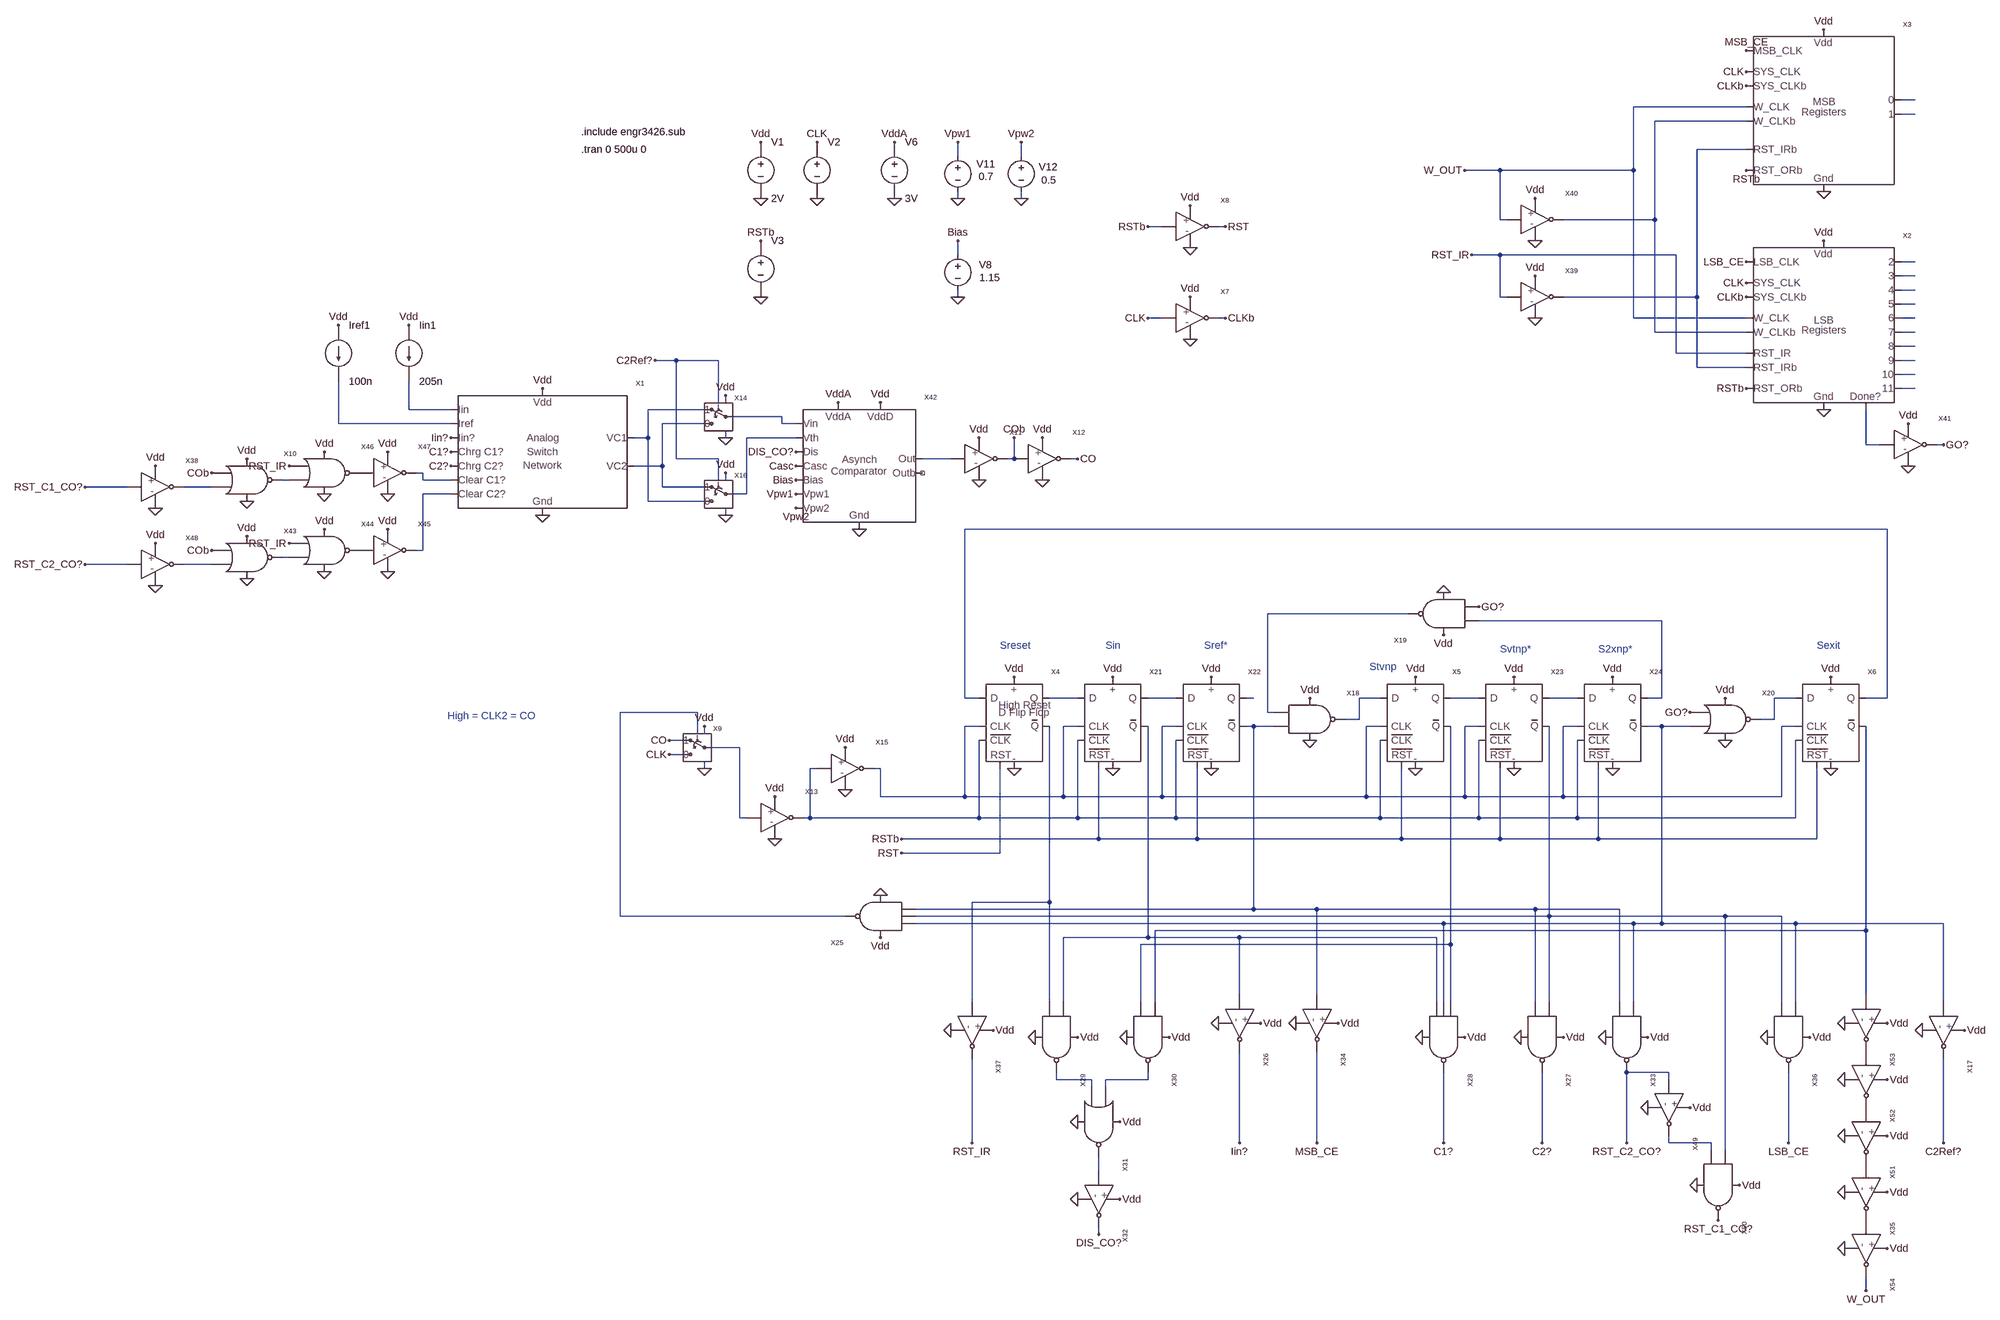
[diagram p0: schematic adc_test.asc]
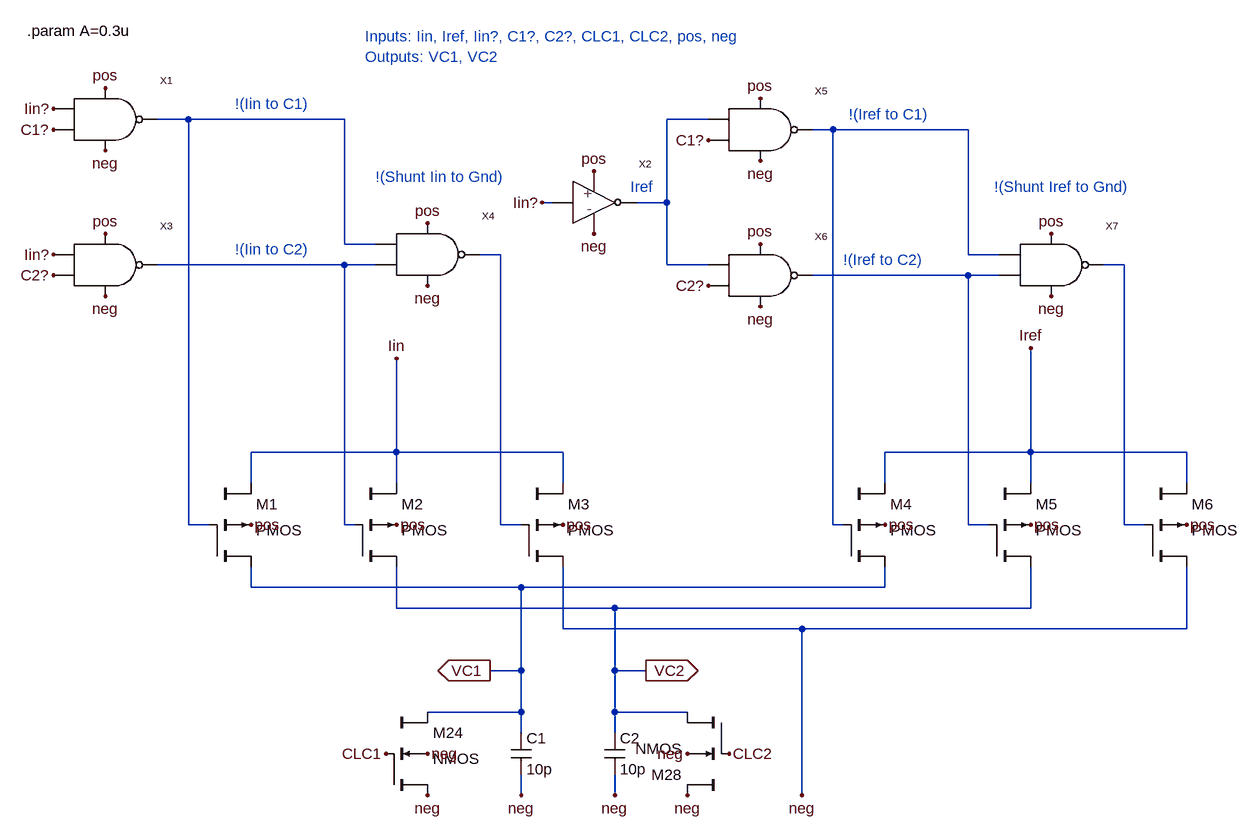
[diagram p1: sub-circuit analog_switch_current_steer.asc]
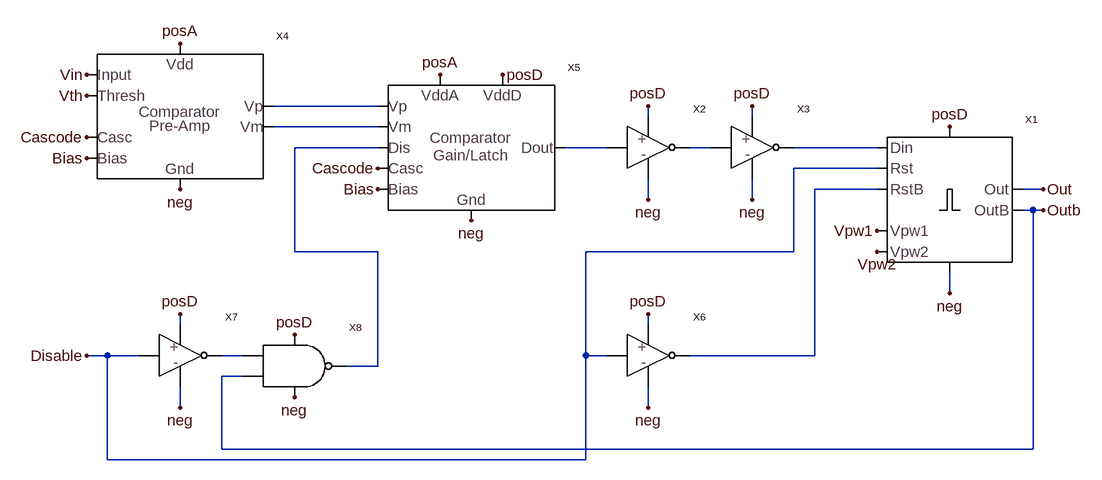
[diagram p2: sub-circuit comparator.asc]
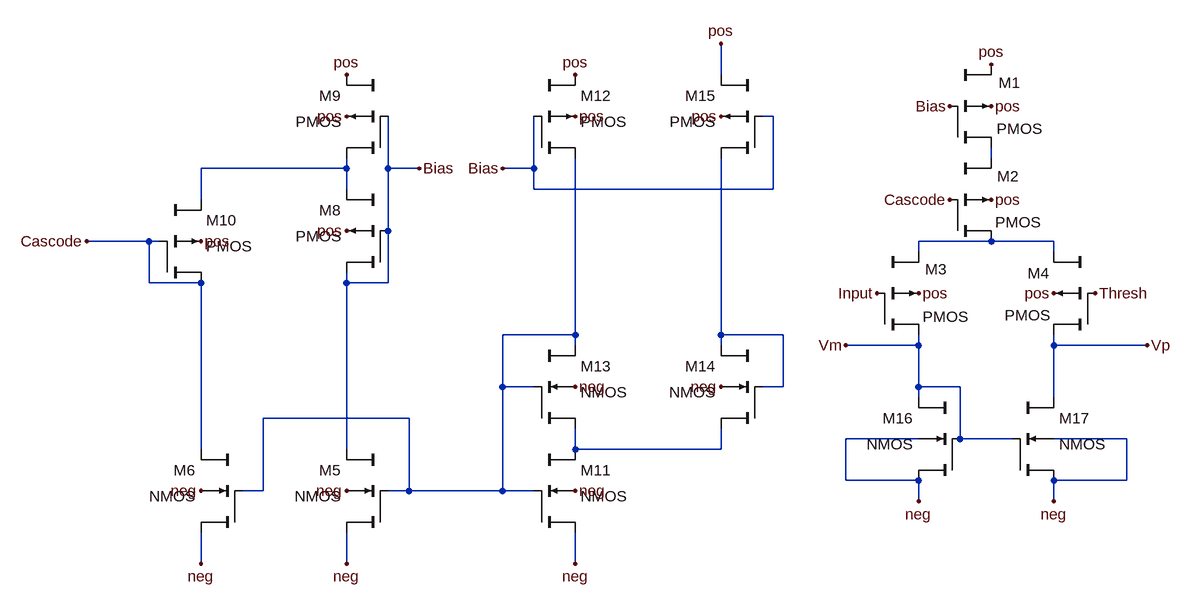
[diagram p3: sub-circuit comparator_preamp.asc]
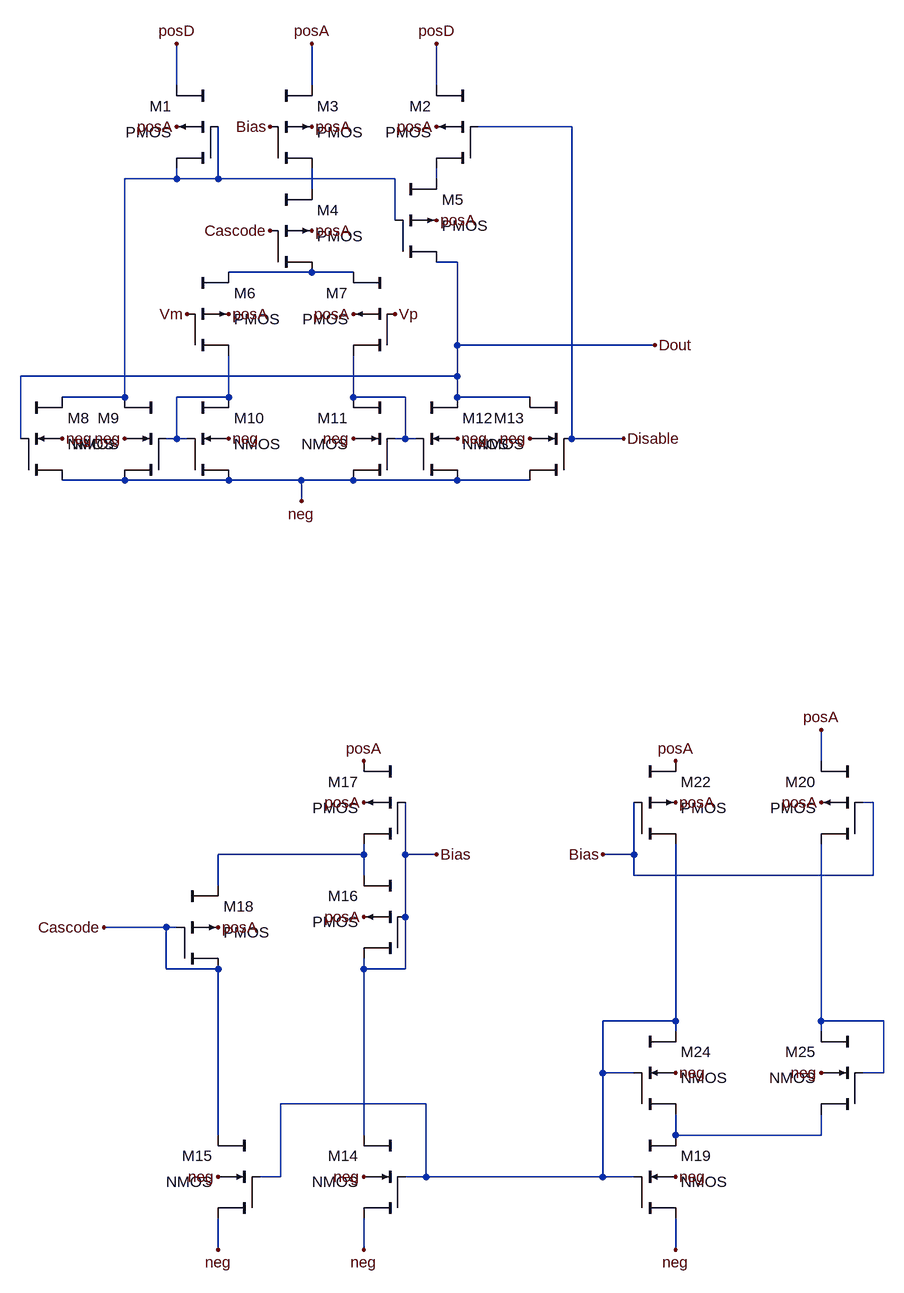
[diagram p4: sub-circuit comparator_gainlatch.asc]
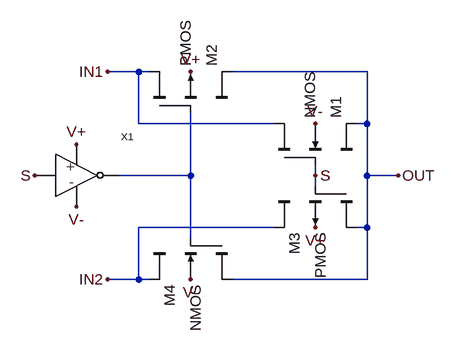
[diagram p5: sub-circuit spdt_1.asc]
adc_test.asc, the LTspice schematic file:
Version 4
SHEET 1 1476 2640
WIRE 1136 -288 1104 -288
WIRE 752 -272 496 -272
WIRE 1136 -256 1104 -256
WIRE 752 -240 544 -240
WIRE 752 -176 640 -176
WIRE -1040 -160 -1040 -192
WIRE -896 -160 -896 -192
WIRE 192 -128 112 -128
WIRE 496 -128 496 -272
WIRE 496 -128 192 -128
WIRE -1040 -64 -1040 -80
WIRE -896 -64 -896 -80
WIRE 192 -16 192 -128
WIRE 208 -16 192 -16
WIRE 544 -16 544 -240
WIRE 544 -16 336 -16
WIRE -576 0 -608 0
WIRE -432 0 -448 0
WIRE -1040 64 -1040 32
WIRE 192 64 128 64
WIRE 592 64 192 64
WIRE 1136 80 1104 80
WIRE 1136 112 1104 112
WIRE 1136 144 1104 144
WIRE -1040 160 -1040 144
WIRE 192 160 192 64
WIRE 208 160 192 160
WIRE 640 160 640 -176
WIRE 640 160 336 160
WIRE 1136 176 1104 176
WIRE -576 208 -608 208
WIRE -432 208 -448 208
WIRE 496 208 496 -128
WIRE 752 208 496 208
WIRE 1136 208 1104 208
WIRE 544 240 544 -16
WIRE 752 240 544 240
WIRE 1136 240 1104 240
WIRE 1136 272 1104 272
WIRE 592 288 592 64
WIRE 752 288 592 288
WIRE -1680 304 -1728 304
WIRE -1584 304 -1680 304
WIRE 1136 304 1104 304
WIRE 640 320 640 160
WIRE 752 320 640 320
WIRE 1136 336 1104 336
WIRE 1136 368 1104 368
WIRE -1584 400 -1584 304
WIRE -1568 400 -1568 384
WIRE -2288 416 -2288 352
WIRE -2192 416 -2288 416
WIRE -1616 416 -1744 416
WIRE -1440 432 -1552 432
WIRE -2448 448 -2448 352
WIRE -2192 448 -2448 448
WIRE -1616 448 -1712 448
WIRE -1440 448 -1440 432
WIRE -1408 448 -1440 448
WIRE -1744 480 -1744 416
WIRE -1744 480 -1776 480
WIRE -1568 480 -1568 464
WIRE -1408 480 -1520 480
WIRE 1024 496 1024 416
WIRE 1056 496 1024 496
WIRE 1200 496 1184 496
WIRE -1680 528 -1680 304
WIRE -1584 528 -1680 528
WIRE -1056 528 -1120 528
WIRE -912 528 -912 480
WIRE -912 528 -928 528
WIRE -768 528 -784 528
WIRE -1712 544 -1712 448
WIRE -1712 544 -1776 544
WIRE -2256 560 -2272 560
WIRE -2560 576 -2576 576
WIRE -2256 576 -2256 560
WIRE -2192 576 -2256 576
WIRE -1584 576 -1584 528
WIRE -1568 576 -1568 560
WIRE -2928 592 -3024 592
WIRE -2736 592 -2800 592
WIRE -1712 592 -1712 544
WIRE -1616 592 -1712 592
WIRE -2192 608 -2256 608
WIRE -1520 608 -1520 480
WIRE -1520 608 -1552 608
WIRE -1744 624 -1744 480
WIRE -1616 624 -1744 624
WIRE -1568 656 -1568 640
WIRE 1072 688 -1024 688
WIRE -2256 736 -2256 608
WIRE -2256 736 -2272 736
WIRE -2560 752 -2576 752
WIRE -2928 768 -3024 768
WIRE -2736 768 -2800 768
WIRE -16 880 -336 880
WIRE 560 896 144 896
WIRE -1024 1072 -1024 688
WIRE -992 1072 -1024 1072
WIRE -768 1072 -832 1072
WIRE -544 1072 -608 1072
WIRE -368 1072 -384 1072
WIRE -80 1072 -128 1072
WIRE 144 1072 80 1072
WIRE 368 1072 304 1072
WIRE 560 1072 560 896
WIRE 560 1072 528 1072
WIRE 864 1072 816 1072
WIRE 1072 1072 1072 688
WIRE 1072 1072 1024 1072
WIRE -1632 1104 -1808 1104
WIRE -336 1104 -336 880
WIRE -320 1104 -336 1104
WIRE -128 1120 -128 1072
WIRE -128 1120 -160 1120
WIRE 816 1120 816 1072
WIRE 816 1120 784 1120
WIRE -992 1136 -1024 1136
WIRE -768 1136 -800 1136
WIRE -544 1136 -576 1136
WIRE -368 1136 -384 1136
WIRE -320 1136 -368 1136
WIRE -80 1136 -112 1136
WIRE 144 1136 112 1136
WIRE 368 1136 336 1136
WIRE 560 1136 528 1136
WIRE 624 1136 560 1136
WIRE 864 1136 832 1136
WIRE -1632 1152 -1632 1104
WIRE -1616 1152 -1616 1136
WIRE -1664 1168 -1696 1168
WIRE -1536 1184 -1600 1184
WIRE -1664 1200 -1696 1200
WIRE -1616 1232 -1616 1216
WIRE -1360 1232 -1376 1232
WIRE -1216 1232 -1232 1232
WIRE -1216 1296 -1216 1232
WIRE -1024 1296 -1024 1136
WIRE -1024 1296 -1216 1296
WIRE -800 1296 -800 1136
WIRE -800 1296 -1024 1296
WIRE -576 1296 -576 1136
WIRE -576 1296 -800 1296
WIRE -112 1296 -112 1136
WIRE -112 1296 -576 1296
WIRE 112 1296 112 1136
WIRE 112 1296 -112 1296
WIRE 336 1296 336 1136
WIRE 336 1296 112 1296
WIRE 832 1296 832 1136
WIRE 832 1296 336 1296
WIRE -1536 1344 -1536 1184
WIRE -1520 1344 -1536 1344
WIRE -1376 1344 -1376 1232
WIRE -1376 1344 -1392 1344
WIRE -992 1344 -992 1168
WIRE -992 1344 -1376 1344
WIRE -768 1344 -768 1168
WIRE -768 1344 -992 1344
WIRE -544 1344 -544 1168
WIRE -544 1344 -768 1344
WIRE -80 1344 -80 1168
WIRE -80 1344 -544 1344
WIRE 144 1344 144 1168
WIRE 144 1344 -80 1344
WIRE 368 1344 368 1168
WIRE 368 1344 144 1344
WIRE 864 1344 864 1168
WIRE 864 1344 368 1344
WIRE -720 1392 -720 1232
WIRE -720 1392 -1168 1392
WIRE -496 1392 -496 1232
WIRE -496 1392 -720 1392
WIRE -32 1392 -32 1232
WIRE -32 1392 -496 1392
WIRE 192 1392 192 1232
WIRE 192 1392 -32 1392
WIRE 416 1392 416 1232
WIRE 416 1392 192 1392
WIRE 912 1392 912 1232
WIRE 912 1392 416 1392
WIRE -944 1424 -944 1232
WIRE -944 1424 -1168 1424
WIRE -832 1536 -832 1136
WIRE -832 1536 -1008 1536
WIRE -368 1552 -368 1136
WIRE -368 1552 -1136 1552
WIRE -224 1552 -368 1552
WIRE 272 1552 -224 1552
WIRE 464 1552 272 1552
WIRE -1808 1568 -1808 1104
WIRE -1296 1568 -1808 1568
WIRE 304 1568 304 1136
WIRE 304 1568 -1136 1568
WIRE 704 1568 304 1568
WIRE 832 1568 704 1568
WIRE 64 1584 -1136 1584
WIRE 496 1584 64 1584
WIRE 560 1584 560 1136
WIRE 560 1584 496 1584
WIRE 864 1584 560 1584
WIRE 1200 1584 864 1584
WIRE 1024 1600 1024 1136
WIRE 1024 1600 -592 1600
WIRE -608 1616 -608 1136
WIRE -608 1616 -800 1616
WIRE -400 1616 -608 1616
WIRE 48 1616 -400 1616
WIRE 80 1632 80 1136
WIRE 80 1632 -624 1632
WIRE -400 1792 -400 1616
WIRE -224 1792 -224 1552
WIRE 1024 1792 1024 1600
WIRE -1008 1808 -1008 1536
WIRE -832 1808 -832 1536
WIRE -800 1808 -800 1616
WIRE -624 1808 -624 1632
WIRE -592 1808 -592 1600
WIRE 48 1808 48 1616
WIRE 64 1808 64 1584
WIRE 80 1808 80 1632
WIRE 272 1808 272 1552
WIRE 304 1808 304 1568
WIRE 464 1808 464 1552
WIRE 496 1808 496 1584
WIRE 832 1808 832 1568
WIRE 864 1808 864 1584
WIRE 1200 1808 1200 1584
WIRE 576 1968 480 1968
WIRE -816 1984 -816 1968
WIRE -736 1984 -816 1984
WIRE -608 1984 -608 1968
WIRE -608 1984 -704 1984
WIRE 576 1984 576 1968
WIRE -736 2000 -736 1984
WIRE -704 2000 -704 1984
WIRE -1008 2128 -1008 1936
WIRE -400 2128 -400 1920
WIRE -224 2128 -224 1920
WIRE 64 2128 64 1968
WIRE 288 2128 288 1968
WIRE 480 2128 480 1968
WIRE 576 2128 576 2112
WIRE 672 2128 576 2128
WIRE 848 2128 848 1968
WIRE 1200 2128 1200 1936
WIRE 672 2144 672 2128
WIRE 704 2144 704 1568
WIRE -720 2192 -720 2160
WIRE -720 2336 -720 2320
WIRE 1024 2464 1024 2432
FLAG -1360 -192 CLK
FLAG -1360 -64 0
FLAG -1488 -64 0
FLAG -912 1232 0
FLAG 0 1232 0
FLAG 944 1232 0
FLAG -1488 -192 Vdd
FLAG -912 1024 Vdd
FLAG 0 1024 Vdd
FLAG 944 1024 Vdd
FLAG -1488 160 0
FLAG -1488 32 RSTb
FLAG -1168 1392 RSTb
FLAG -1696 1200 CLK
FLAG -1456 1392 0
FLAG -1456 1296 Vdd
FLAG -1696 1168 CO
FLAG 144 864 GO?
FLAG -240 1168 0
FLAG 64 832 0
FLAG -240 1072 Vdd
FLAG 64 928 Vdd
FLAG 624 1104 GO?
FLAG 704 1168 0
FLAG 704 1072 Vdd
FLAG -688 1232 0
FLAG -688 1024 Vdd
FLAG -464 1232 0
FLAG -464 1024 Vdd
FLAG 224 1232 0
FLAG 224 1024 Vdd
FLAG 448 1232 0
FLAG 448 1024 Vdd
FLAG -1216 1520 0
FLAG -1216 1616 Vdd
FLAG -352 1856 Vdd
FLAG -448 1856 0
FLAG -400 2128 Iin?
FLAG 112 1888 Vdd
FLAG 16 1888 0
FLAG 64 2128 C1?
FLAG 336 1888 Vdd
FLAG 240 1888 0
FLAG 288 2128 C2?
FLAG -864 1888 0
FLAG -656 1888 0
FLAG -768 1888 Vdd
FLAG -560 1888 Vdd
FLAG -720 2336 DIS_CO?
FLAG -768 2080 0
FLAG -768 2256 0
FLAG -672 2080 Vdd
FLAG -672 2256 Vdd
FLAG 528 1888 Vdd
FLAG 432 1888 0
FLAG 480 2128 RST_C2_CO?
FLAG -176 1856 Vdd
FLAG -272 1856 0
FLAG -224 2128 MSB_CE
FLAG 1024 2464 W_OUT
FLAG 896 1888 Vdd
FLAG 800 1888 0
FLAG 848 2128 LSB_CE
FLAG -960 1872 Vdd
FLAG -1056 1872 0
FLAG -1008 2128 RST_IR
FLAG -1984 368 Vdd
FLAG -1984 656 0
FLAG -2192 480 Iin?
FLAG -2288 224 Vdd
FLAG -2448 224 Vdd
FLAG -2192 512 C1?
FLAG -2192 544 C2?
FLAG -3024 592 RST_C1_CO?
FLAG -2864 640 0
FLAG -2864 544 Vdd
FLAG 752 -400 MSB_CE
FLAG 928 -448 Vdd
FLAG 928 32 Vdd
FLAG 928 -80 0
FLAG 928 416 0
FLAG 752 80 LSB_CE
FLAG 752 368 RSTb
FLAG 752 -128 RSTb
FLAG 128 64 RST_IR
FLAG 272 208 0
FLAG 272 112 Vdd
FLAG 112 -128 W_OUT
FLAG 272 32 0
FLAG 272 -64 Vdd
FLAG 1120 544 0
FLAG 1120 448 Vdd
FLAG 1200 496 GO?
FLAG -1264 688 0
FLAG -1408 512 DIS_CO?
FLAG -912 480 COb
FLAG -1216 400 Vdd
FLAG -1184 -64 0
FLAG -1184 -192 VddA
FLAG -1312 400 VddA
FLAG -1040 -64 0
FLAG -1040 -192 Vpw1
FLAG -896 -64 0
FLAG -896 -192 Vpw2
FLAG -1040 160 0
FLAG -1040 32 Bias
FLAG -1408 544 Casc
FLAG -1408 576 Bias
FLAG -1408 608 Vpw1
FLAG -1408 640 Vpw2
FLAG -512 256 0
FLAG -512 160 Vdd
FLAG -608 208 CLK
FLAG -432 208 CLKb
FLAG 752 -352 CLK
FLAG 752 -320 CLKb
FLAG 752 160 CLKb
FLAG 752 128 CLK
FLAG -768 528 CO
FLAG -2656 624 0
FLAG -2656 528 Vdd
FLAG -2736 560 COb
FLAG -2656 800 0
FLAG -2656 704 Vdd
FLAG -2736 736 COb
FLAG -2480 784 0
FLAG -2336 784 0
FLAG -2480 688 Vdd
FLAG -2336 688 Vdd
FLAG -2480 608 0
FLAG -2336 608 0
FLAG -2480 512 Vdd
FLAG -2336 512 Vdd
FLAG -2560 720 RST_IR
FLAG -2560 544 RST_IR
FLAG -2864 816 0
FLAG -2864 720 Vdd
FLAG -3024 768 RST_C2_CO?
FLAG 624 2048 Vdd
FLAG 528 2048 0
FLAG 736 2224 Vdd
FLAG 640 2224 0
FLAG 688 2304 RST_C1_CO?
FLAG -1168 1424 RST
FLAG -512 48 0
FLAG -512 -48 Vdd
FLAG -608 0 RSTb
FLAG -432 0 RST
FLAG -1616 1136 Vdd
FLAG -1616 1232 0
FLAG -992 576 0
FLAG -992 480 Vdd
FLAG -848 576 0
FLAG -848 480 Vdd
FLAG -1568 384 Vdd
FLAG -1568 480 0
FLAG -1296 1280 0
FLAG -1296 1184 Vdd
FLAG -1568 560 Vdd
FLAG -1568 656 0
FLAG 1248 1872 Vdd
FLAG 1152 1872 0
FLAG 1200 2128 C2Ref?
FLAG -1728 304 C2Ref?
FLAG 1072 2368 Vdd
FLAG 976 2368 0
FLAG 1072 2240 Vdd
FLAG 976 2240 0
FLAG 1072 2112 Vdd
FLAG 976 2112 0
FLAG 1072 1984 Vdd
FLAG 976 1984 0
FLAG 1072 1856 Vdd
FLAG 976 1856 0
SYMBOL analog_switch_current_steer -1984 512 R0
SYMATTR InstName X1
SYMBOL lsb_registers 928 224 R0
SYMATTR InstName X2
SYMBOL msb_registers 928 -272 R0
SYMATTR InstName X3
SYMBOL FlipFlop 0 1136 R0
SYMATTR InstName X5
SYMATTR SpiceLine nmosL=0.9u nmosW=3u pmosL=0.9u pmosW=6u
SYMBOL FlipFlop 944 1136 R0
SYMATTR InstName X6
SYMATTR SpiceLine nmosL=0.9u nmosW=3u pmosL=0.9u pmosW=6u
SYMBOL cktsym\\vsource -1488 -128 R0
WINDOW 123 0 0 Left 2
WINDOW 39 0 0 Left 2
SYMATTR Value 2V
SYMATTR InstName V1
SYMBOL cktsym\\vsource -1360 -128 R0
WINDOW 3 48 12 Invisible 2
WINDOW 123 0 0 Left 2
WINDOW 39 0 0 Left 2
SYMATTR Value PULSE(0 2 .2u 1n 1n 5u 10u 50)
SYMATTR InstName V2
SYMBOL cktsym\\vsource -1488 96 R0
WINDOW 3 48 16 Invisible 2
WINDOW 123 0 0 Left 2
WINDOW 39 0 0 Left 2
SYMATTR Value PWL(0 0 300n 0 325n 2 40u 2)
SYMATTR InstName V3
SYMBOL Inverter -1456 1344 R0
SYMATTR InstName X13
SYMATTR SpiceLine nmosL=0.9u nmosW=6u pmosL=0.9u pmosW=12u
SYMBOL NAND -240 1120 R0
SYMATTR InstName X18
SYMATTR SpiceLine nmosL=0.9u nmosW=3u pmosL=0.9u pmosW=6u
SYMBOL NAND 64 880 R180
SYMATTR InstName X19
SYMATTR SpiceLine nmosL=0.9u nmosW=3u pmosL=0.9u pmosW=6u
SYMBOL NOR 704 1120 R0
SYMATTR InstName X20
SYMATTR SpiceLine nmosL=0.9u nmosW=3u pmosL=0.9u pmosW=6u
SYMBOL FlipFlop -688 1136 R0
SYMATTR InstName X21
SYMATTR SpiceLine nmosL=0.9u nmosW=3u pmosL=0.9u pmosW=6u
SYMBOL FlipFlop -464 1136 R0
SYMATTR InstName X22
SYMATTR SpiceLine nmosL=0.9u nmosW=3u pmosL=0.9u pmosW=6u
SYMBOL FlipFlop 224 1136 R0
SYMATTR InstName X23
SYMATTR SpiceLine nmosL=0.9u nmosW=3u pmosL=0.9u pmosW=6u
SYMBOL FlipFlop 448 1136 R0
SYMATTR InstName X24
SYMATTR SpiceLine nmosL=0.9u nmosW=3u pmosL=0.9u pmosW=6u
SYMBOL NAND3 -1216 1568 R180
SYMATTR InstName X25
SYMATTR SpiceLine nmosL=0.9u nmosW=3u pmosL=0.9u pmosW=6u
SYMBOL Inverter -400 1856 R90
SYMATTR InstName X26
SYMATTR SpiceLine nmosL=0.9u nmosW=3u pmosL=0.9u pmosW=6u
SYMBOL NAND 288 1888 R90
SYMATTR InstName X27
SYMATTR SpiceLine nmosL=0.9u nmosW=3u pmosL=0.9u pmosW=6u
SYMBOL NAND3 64 1888 R90
SYMATTR InstName X28
SYMATTR SpiceLine nmosL=0.9u nmosW=3u pmosL=0.9u pmosW=6u
SYMBOL NAND -816 1888 R90
SYMATTR InstName X29
SYMATTR SpiceLine nmosL=0.9u nmosW=3u pmosL=0.9u pmosW=6u
SYMBOL NAND -608 1888 R90
SYMATTR InstName X30
SYMATTR SpiceLine nmosL=0.9u nmosW=3u pmosL=0.9u pmosW=6u
SYMBOL NOR -720 2080 R90
SYMATTR InstName X31
SYMATTR SpiceLine nmosL=0.9u nmosW=3u pmosL=0.9u pmosW=6u
SYMBOL Inverter -720 2256 R90
SYMATTR InstName X32
SYMATTR SpiceLine nmosL=0.9u nmosW=3u pmosL=0.9u pmosW=6u
SYMBOL Inverter -224 1856 R90
SYMATTR InstName X34
SYMATTR SpiceLine nmosL=0.9u nmosW=6u pmosL=0.9u pmosW=12u
SYMBOL NAND 848 1888 R90
SYMATTR InstName X36
SYMATTR SpiceLine nmosL=0.9u nmosW=9u pmosL=0.9u pmosW=18u
SYMBOL Inverter -1008 1872 R90
SYMATTR InstName X37
SYMATTR SpiceLine nmosL=0.9u nmosW=3u pmosL=0.9u pmosW=6u
SYMBOL cktsym\\isource -2288 288 R0
WINDOW 123 0 0 Left 2
WINDOW 39 0 0 Left 2
SYMATTR Value 205n
SYMATTR InstName Iin1
SYMBOL cktsym\\isource -2448 288 R0
WINDOW 123 0 0 Left 2
WINDOW 39 0 0 Left 2
SYMATTR Value 100n
SYMATTR InstName Iref1
SYMBOL Inverter -2864 592 R0
SYMATTR InstName X38
SYMATTR SpiceLine nmosL=0.9u nmosW=3u pmosL=0.9u pmosW=6u
SYMBOL Inverter 272 160 R0
SYMATTR InstName X39
SYMATTR SpiceLine nmosL=0.9u nmosW=9u pmosL=0.9u pmosW=18u
SYMBOL Inverter 272 -16 R0
SYMATTR InstName X40
SYMATTR SpiceLine nmosL=0.9u nmosW=9u pmosL=0.9u pmosW=18u
SYMBOL Inverter 1120 496 R0
SYMATTR InstName X41
SYMATTR SpiceLine nmosL=0.9u nmosW=3u pmosL=0.9u pmosW=6u
SYMBOL comparator -1264 544 R0
SYMATTR InstName X42
SYMBOL cktsym\\vsource -1184 -128 R0
WINDOW 123 0 0 Left 2
WINDOW 39 0 0 Left 2
SYMATTR Value 3V
SYMATTR InstName V6
SYMBOL voltage -1040 -176 R0
WINDOW 123 0 0 Left 2
WINDOW 39 0 0 Left 2
WINDOW 0 42 34 Left 2
WINDOW 3 47 62 Left 2
SYMATTR InstName V11
SYMATTR Value 0.7
SYMBOL voltage -896 -176 R0
WINDOW 123 0 0 Left 2
WINDOW 39 0 0 Left 2
WINDOW 0 40 40 Left 2
WINDOW 3 46 70 Left 2
SYMATTR InstName V12
SYMATTR Value 0.5
SYMBOL voltage -1040 48 R0
WINDOW 123 0 0 Left 2
WINDOW 39 0 0 Left 2
WINDOW 0 48 39 Left 2
WINDOW 3 49 68 Left 2
SYMATTR InstName V8
SYMATTR Value 1.15
SYMBOL Inverter -512 208 R0
SYMATTR InstName X7
SYMATTR SpiceLine nmosL=0.9u nmosW=9u pmosL=0.9u pmosW=18u
SYMBOL NOR -2656 576 R0
SYMATTR InstName X10
SYMATTR SpiceLine nmosL=0.9u nmosW=3u pmosL=0.9u pmosW=6u
SYMBOL NOR -2656 752 R0
SYMATTR InstName X43
SYMATTR SpiceLine nmosL=0.9u nmosW=3u pmosL=0.9u pmosW=6u
SYMBOL NOR -2480 736 R0
SYMATTR InstName X44
SYMATTR SpiceLine nmosL=0.9u nmosW=3u pmosL=0.9u pmosW=6u
SYMBOL Inverter -2336 736 R0
SYMATTR InstName X45
SYMATTR SpiceLine nmosL=0.9u nmosW=3u pmosL=0.9u pmosW=6u
SYMBOL NOR -2480 560 R0
SYMATTR InstName X46
SYMATTR SpiceLine nmosL=0.9u nmosW=3u pmosL=0.9u pmosW=6u
SYMBOL Inverter -2336 560 R0
SYMATTR InstName X47
SYMATTR SpiceLine nmosL=0.9u nmosW=3u pmosL=0.9u pmosW=6u
SYMBOL Inverter -2864 768 R0
SYMATTR InstName X48
SYMATTR SpiceLine nmosL=0.9u nmosW=3u pmosL=0.9u pmosW=6u
SYMBOL Inverter 576 2048 R90
SYMATTR InstName X49
SYMATTR SpiceLine nmosL=0.9u nmosW=3u pmosL=0.9u pmosW=6u
SYMBOL NAND 688 2224 R90
SYMATTR InstName X50
SYMATTR SpiceLine nmosL=0.9u nmosW=3u pmosL=0.9u pmosW=6u
SYMBOL NAND 480 1888 R90
SYMATTR InstName X33
SYMATTR SpiceLine nmosL=0.9u nmosW=3u pmosL=0.9u pmosW=6u
SYMBOL highResetFlipFlop -912 1136 R0
SYMATTR InstName X4
SYMATTR SpiceLine nmosL=0.9u nmosW=3u pmosL=0.9u pmosW=6u
SYMBOL Inverter -512 0 R0
SYMATTR InstName X8
SYMATTR SpiceLine nmosL=0.9u nmosW=9u pmosL=0.9u pmosW=18u
SYMBOL SPDT_1 -1616 1184 R0
SYMATTR InstName X9
SYMATTR SpiceLine nmosL=0.9u nmosW=3u pmosL=0.9u pmosW=6u
SYMBOL Inverter -992 528 R0
SYMATTR InstName X11
SYMATTR SpiceLine nmosL=0.9u nmosW=6u pmosL=0.9u pmosW=12u
SYMBOL Inverter -848 528 R0
SYMATTR InstName X12
SYMATTR SpiceLine nmosL=0.9u nmosW=6u pmosL=0.9u pmosW=12u
SYMBOL SPDT_1 -1568 432 R0
SYMATTR InstName X14
SYMATTR SpiceLine nmosL=0.9u nmosW=3u pmosL=0.9u pmosW=6u
SYMBOL Inverter -1296 1232 R0
SYMATTR InstName X15
SYMATTR SpiceLine nmosL=0.9u nmosW=6u pmosL=0.9u pmosW=12u
SYMBOL SPDT_1 -1568 608 R0
SYMATTR InstName X16
SYMATTR SpiceLine nmosL=0.9u nmosW=3u pmosL=0.9u pmosW=6u
SYMBOL Inverter 1200 1872 R90
SYMATTR InstName X17
SYMATTR SpiceLine nmosL=0.9u nmosW=3u pmosL=0.9u pmosW=6u
SYMBOL Inverter 1024 2368 R90
SYMATTR InstName X54
SYMATTR SpiceLine nmosL=0.9u nmosW=9u pmosL=0.9u pmosW=18u
SYMBOL Inverter 1024 2240 R90
SYMATTR InstName X35
SYMATTR SpiceLine nmosL=0.9u nmosW=0.9u pmosL=0.9u pmosW=1.8u
SYMBOL Inverter 1024 2112 R90
SYMATTR InstName X51
SYMATTR SpiceLine nmosL=0.9u nmosW=0.9u pmosL=0.9u pmosW=1.8u
SYMBOL Inverter 1024 1984 R90
SYMATTR InstName X52
SYMATTR SpiceLine nmosL=0.9u nmosW=0.9u pmosL=0.9u pmosW=1.8u
SYMBOL Inverter 1024 1856 R90
SYMATTR InstName X53
SYMATTR SpiceLine nmosL=0.9u nmosW=0.9u pmosL=0.9u pmosW=1.8u
TEXT -1896 -176 Left 2 !.tran 0 500u 0
TEXT -1896 -216 Left 2 !.include engr3426.sub
TEXT -944 952 Left 2 ;Sreset
TEXT -704 952 Left 2 ;Sin
TEXT -480 952 Left 2 ;Sref*
TEXT -104 1000 Left 2 ;Stvnp
TEXT 192 960 Left 2 ;Svtnp*
TEXT 416 960 Left 2 ;S2xnp*
TEXT 912 952 Left 2 ;Sexit
TEXT -2200 1112 Left 2 ;High = CLK2 = CO

analog_switch_current_steer.asc, the sub-circuit schematic file:
Version 4
SHEET 1 2628 980
WIRE 272 -576 224 -576
WIRE 512 -576 272 -576
WIRE 1072 -576 1008 -576
WIRE 1264 -560 1232 -560
WIRE 1472 -560 1264 -560
WIRE 832 -448 816 -448
WIRE 1008 -448 1008 -576
WIRE 1008 -448 960 -448
WIRE 512 -384 512 -576
WIRE 560 -384 512 -384
WIRE 752 -368 720 -368
WIRE 1472 -368 1472 -560
WIRE 1520 -368 1472 -368
WIRE 512 -352 224 -352
WIRE 560 -352 512 -352
WIRE 1008 -352 1008 -448
WIRE 1072 -352 1008 -352
WIRE 1712 -352 1680 -352
WIRE 1472 -336 1232 -336
WIRE 1520 -336 1472 -336
WIRE 592 -64 592 -208
WIRE 592 -64 368 -64
WIRE 848 -64 592 -64
WIRE 1568 -64 1568 -224
WIRE 1568 -64 1344 -64
WIRE 1808 -64 1568 -64
WIRE 368 -16 368 -64
WIRE 592 -16 592 -64
WIRE 848 -16 848 -64
WIRE 1344 -16 1344 -64
WIRE 1568 -16 1568 -64
WIRE 1808 -16 1808 -64
WIRE 272 48 272 -576
WIRE 304 48 272 48
WIRE 512 48 512 -352
WIRE 528 48 512 48
WIRE 752 48 752 -368
WIRE 784 48 752 48
WIRE 1264 48 1264 -560
WIRE 1280 48 1264 48
WIRE 1472 48 1472 -336
WIRE 1504 48 1472 48
WIRE 1712 48 1712 -352
WIRE 1744 48 1712 48
WIRE 368 144 368 112
WIRE 784 144 368 144
WIRE 1344 144 1344 112
WIRE 1344 144 784 144
WIRE 592 176 592 112
WIRE 928 176 592 176
WIRE 1568 176 1568 112
WIRE 1568 176 928 176
WIRE 848 208 848 112
WIRE 1216 208 848 208
WIRE 1808 208 1808 112
WIRE 1808 208 1216 208
WIRE 784 272 784 144
WIRE 784 272 736 272
WIRE 928 272 928 176
WIRE 976 272 928 272
WIRE 784 336 784 272
WIRE 784 336 640 336
WIRE 928 336 928 272
WIRE 1040 336 928 336
WIRE 784 368 784 336
WIRE 928 368 928 336
WIRE 784 464 784 432
WIRE 928 464 928 432
WIRE 1216 464 1216 208
FLAG 368 48 pos
FLAG 592 48 pos
FLAG 1344 48 pos
FLAG 1568 48 pos
FLAG 1808 48 pos
FLAG 816 -448 Iin?
FLAG 576 400 CLC1
FLAG 1104 400 CLC2
FLAG 848 48 pos
FLAG 640 464 neg
FLAG 784 464 neg
FLAG 928 464 neg
FLAG 1040 464 neg
FLAG 640 400 neg
FLAG 1040 400 neg
FLAG 1216 464 neg
FLAG 64 -560 C1?
FLAG 64 -592 Iin?
FLAG 144 -624 pos
FLAG 144 -528 neg
FLAG 896 -400 neg
FLAG 896 -496 pos
FLAG 64 -336 C2?
FLAG 64 -368 Iin?
FLAG 144 -400 pos
FLAG 144 -304 neg
FLAG 640 -416 pos
FLAG 640 -320 neg
FLAG 1072 -544 C1?
FLAG 1152 -608 pos
FLAG 1152 -512 neg
FLAG 1072 -320 C2?
FLAG 1152 -384 pos
FLAG 1152 -288 neg
FLAG 1600 -400 pos
FLAG 1600 -304 neg
FLAG 592 -208 Iin
FLAG 1568 -224 Iref
FLAG 736 272 VC1
IOPIN 736 272 Out
FLAG 976 272 VC2
IOPIN 976 272 Out
SYMBOL cktsym\\pmos4 368 48 R0
SYMATTR InstName M1
SYMATTR Value2 l={2*A} w={6*A}
SYMBOL cktsym\\pmos4 592 48 R0
SYMATTR InstName M2
SYMATTR Value2 l={2*A} w={6*A}
SYMBOL cktsym\\pmos4 1344 48 R0
SYMATTR InstName M4
SYMATTR Value2 l={2*A} w={6*A}
SYMBOL cktsym\\pmos4 1568 48 R0
SYMATTR InstName M5
SYMATTR Value2 l={2*A} w={6*A}
SYMBOL cktsym\\pmos4 1808 48 R0
SYMATTR InstName M6
SYMATTR Value2 l={2*A} w={6*A}
SYMBOL cap 768 368 R0
SYMATTR InstName C1
SYMATTR Value 10p
SYMBOL cap 912 368 R0
SYMATTR InstName C2
SYMATTR Value 10p
SYMBOL cktsym\\nmos4 640 400 R0
SYMATTR InstName M24
SYMATTR Value2 l={2*A} w={24*A}
SYMBOL cktsym\\nmos4 1040 400 R180
SYMATTR InstName M28
SYMATTR Value2 l={2*A} w={24*A}
SYMBOL cktsym\\pmos4 848 48 R0
SYMATTR InstName M3
SYMATTR Value2 l={2*A} w={6*A}
SYMBOL NAND 144 -576 R0
SYMATTR InstName X1
SYMATTR SpiceLine nmosL={2*A} pmosL={2*A} nmosW={3*A} pmosW={6*A}
SYMBOL Inverter 896 -448 R0
SYMATTR InstName X2
SYMATTR SpiceLine nmosL={2*A} pmosL={2*A} nmosW={3*A} pmosW={6*A}
SYMBOL NAND 144 -352 R0
SYMATTR InstName X3
SYMATTR SpiceLine nmosL={2*A} pmosL={2*A} nmosW={3*A} pmosW={6*A}
SYMBOL NAND 640 -368 R0
SYMATTR InstName X4
SYMATTR SpiceLine nmosL={2*A} pmosL={2*A} nmosW={3*A} pmosW={6*A}
SYMBOL NAND 1152 -560 R0
SYMATTR InstName X5
SYMATTR SpiceLine nmosL={2*A} pmosL={2*A} nmosW={3*A} pmosW={6*A}
SYMBOL NAND 1152 -336 R0
SYMATTR InstName X6
SYMATTR SpiceLine nmosL={2*A} pmosL={2*A} nmosW={3*A} pmosW={6*A}
SYMBOL NAND 1600 -352 R0
SYMATTR InstName X7
SYMATTR SpiceLine nmosL={2*A} pmosL={2*A} nmosW={3*A} pmosW={6*A}
TEXT 344 -376 Left 2 ;!(Iin to C2)
TEXT 344 -600 Left 2 ;!(Iin to C1)
TEXT 24 -712 Left 2 !.param A=0.3u
TEXT 560 -488 Left 2 ;!(Shunt Iin to Gnd)
TEXT 952 -472 Left 2 ;Iref
TEXT 1288 -584 Left 2 ;!(Iref to C1)
TEXT 1280 -360 Left 2 ;!(Iref to C2)
TEXT 1512 -472 Left 2 ;!(Shunt Iref to Gnd)
TEXT 544 -704 Left 2 ;Inputs: Iin, Iref, Iin?, C1?, C2?, CLC1, CLC2, pos, neg
TEXT 544 -672 Left 2 ;Outputs: VC1, VC2

comparator.asc, the sub-circuit schematic file:
Version 4
SHEET 1 1636 1340
WIRE 528 784 368 784
WIRE 944 800 944 784
WIRE 1104 800 1104 784
WIRE 528 816 368 816
WIRE 528 848 400 848
WIRE 880 848 816 848
WIRE 1040 848 1008 848
WIRE 1296 848 1168 848
WIRE 1296 880 1168 880
WIRE 1296 912 1200 912
WIRE 1552 912 1520 912
WIRE 944 928 944 896
WIRE 1104 928 1104 896
WIRE 1536 944 1520 944
WIRE 1552 944 1536 944
WIRE 400 1008 400 848
WIRE 528 1008 400 1008
WIRE 1168 1008 1168 880
WIRE 1168 1008 848 1008
WIRE 1408 1072 1408 1040
WIRE 224 1120 224 1104
WIRE 944 1120 944 1104
WIRE 112 1168 80 1168
WIRE 160 1168 112 1168
WIRE 320 1168 288 1168
WIRE 848 1168 848 1008
WIRE 880 1168 848 1168
WIRE 1200 1168 1200 912
WIRE 1200 1168 1008 1168
WIRE 528 1184 528 1008
WIRE 528 1184 480 1184
WIRE 320 1200 288 1200
WIRE 224 1248 224 1216
WIRE 944 1248 944 1216
WIRE 288 1312 288 1200
WIRE 1536 1312 1536 944
WIRE 1536 1312 288 1312
WIRE 112 1328 112 1168
WIRE 848 1328 848 1168
WIRE 848 1328 112 1328
FLAG 80 832 Cascode
FLAG 80 864 Bias
FLAG 528 912 Bias
FLAG 528 880 Cascode
FLAG 624 736 posA
FLAG 224 688 posA
FLAG 80 768 Vth
FLAG 80 736 Vin
FLAG 720 736 posD
FLAG 1408 816 posD
FLAG 1296 1008 Vpw2
FLAG 1296 976 Vpw1
FLAG 944 784 posD
FLAG 1104 784 posD
FLAG 1552 912 Out
FLAG 1552 944 Outb
FLAG 80 1168 Disable
FLAG 944 1104 posD
FLAG 224 912 neg
FLAG 672 960 neg
FLAG 944 928 neg
FLAG 1104 928 neg
FLAG 1408 1072 neg
FLAG 944 1248 neg
FLAG 224 1104 posD
FLAG 224 1248 neg
FLAG 400 1232 neg
FLAG 400 1136 posD
SYMBOL pulse_width_control 1408 928 R0
SYMATTR InstName X1
SYMATTR SpiceLine A=0.3u
SYMBOL Inverter 944 848 R0
SYMATTR InstName X2
SYMATTR SpiceLine nmosL=0.9u nmosW=3u pmosL=0.9u pmosW=6u
SYMBOL Inverter 1104 848 R0
SYMATTR InstName X3
SYMATTR SpiceLine nmosL=0.9u nmosW=3u pmosL=0.9u pmosW=6u
SYMBOL comparator_preamp 224 800 R0
SYMATTR InstName X4
SYMBOL comparator_gainlatch 672 848 R0
SYMATTR InstName X5
SYMBOL Inverter 944 1168 R0
SYMATTR InstName X6
SYMATTR SpiceLine nmosL=0.9u nmosW=3u pmosL=0.9u pmosW=6u
SYMBOL Inverter 224 1168 R0
SYMATTR InstName X7
SYMATTR SpiceLine nmosL=0.9u nmosW=3u pmosL=0.9u pmosW=6u
SYMBOL NAND 400 1184 R0
SYMATTR InstName X8
SYMATTR SpiceLine nmosL=0.9u nmosW=3u pmosL=0.9u pmosW=6u

comparator_preamp.asc, the sub-circuit schematic file:
Version 4
SHEET 1 1144 1268
WIRE -864 -32 -864 -80
WIRE -784 32 -800 32
WIRE -448 96 -448 80
WIRE -1440 112 -1440 96
WIRE -1440 112 -1664 112
WIRE -1376 112 -1376 32
WIRE -1328 112 -1376 112
WIRE -1152 112 -1152 32
WIRE -1152 112 -1200 112
WIRE -1440 144 -1440 112
WIRE -1152 144 -1152 112
WIRE -784 144 -784 32
WIRE -784 144 -1152 144
WIRE -1664 160 -1664 112
WIRE -1376 208 -1376 112
WIRE -1744 224 -1840 224
WIRE -1728 224 -1744 224
WIRE -448 224 -560 224
WIRE -352 224 -448 224
WIRE -560 240 -560 224
WIRE -352 240 -352 224
WIRE -1744 288 -1744 224
WIRE -1664 288 -1744 288
WIRE -1440 288 -1440 272
WIRE -1376 288 -1376 208
WIRE -1376 288 -1440 288
WIRE -1088 368 -1088 96
WIRE -1088 368 -1200 368
WIRE -864 368 -864 96
WIRE -768 368 -864 368
WIRE -1088 384 -1088 368
WIRE -864 384 -864 368
WIRE -560 384 -560 368
WIRE -560 384 -672 384
WIRE -352 384 -352 368
WIRE -208 384 -352 384
WIRE -1200 448 -1200 368
WIRE -1152 448 -1200 448
WIRE -768 448 -768 368
WIRE -768 448 -800 448
WIRE -560 448 -560 384
WIRE -496 448 -560 448
WIRE -560 464 -560 448
WIRE -352 464 -352 384
WIRE -1344 496 -1568 496
WIRE -560 528 -672 528
WIRE -496 528 -496 448
WIRE -416 528 -496 528
WIRE -240 528 -352 528
WIRE -1664 544 -1664 288
WIRE -1440 544 -1440 288
WIRE -1088 544 -1088 512
WIRE -864 544 -864 512
WIRE -864 544 -1088 544
WIRE -672 592 -672 528
WIRE -560 592 -672 592
WIRE -240 592 -240 528
WIRE -240 592 -352 592
WIRE -1568 608 -1568 496
WIRE -1568 608 -1600 608
WIRE -1344 608 -1344 496
WIRE -1344 608 -1376 608
WIRE -1200 608 -1200 448
WIRE -1200 608 -1344 608
WIRE -1152 608 -1200 608
WIRE -560 624 -560 592
WIRE -352 624 -352 592
WIRE -1664 720 -1664 672
WIRE -1440 720 -1440 672
WIRE -1088 720 -1088 672
FLAG -560 304 pos
FLAG -352 304 pos
FLAG -448 160 pos
FLAG -448 16 pos
FLAG -448 -48 pos
FLAG -624 304 Input
FLAG -288 304 Thresh
FLAG -512 160 Cascode
FLAG -512 16 Bias
FLAG -208 384 Vp
FLAG -672 384 Vm
FLAG -1440 608 neg
FLAG -1664 608 neg
FLAG -1440 720 neg
FLAG -1664 720 neg
FLAG -1440 208 pos
FLAG -1440 32 pos
FLAG -1440 -32 pos
FLAG -1664 224 pos
FLAG -1840 224 Cascode
FLAG -1328 112 Bias
FLAG -1088 608 neg
FLAG -1088 720 neg
FLAG -1088 32 pos
FLAG -1088 -32 pos
FLAG -1200 112 Bias
FLAG -1088 448 neg
FLAG -864 448 neg
FLAG -864 32 pos
FLAG -864 -80 pos
FLAG -560 624 neg
FLAG -352 624 neg
SYMBOL cktsym\\pmos4 -448 16 R0
WINDOW 0 11 -36 Left 2
WINDOW 3 8 35 Left 2
SYMATTR InstName M1
SYMATTR Value2 l=4u w=16u
SYMBOL cktsym\\pmos4 -448 160 R0
WINDOW 0 9 -36 Left 2
WINDOW 3 6 35 Left 2
SYMATTR InstName M2
SYMATTR Value2 l=.8u w=3.2u
SYMBOL cktsym\\pmos4 -560 304 R0
WINDOW 0 10 -37 Left 2
WINDOW 3 6 36 Left 2
SYMATTR InstName M3
SYMATTR Value2 l=1u w=3u
SYMBOL cktsym\\pmos4 -352 304 M0
WINDOW 0 6 -31 Left 2
WINDOW 3 5 34 Left 2
SYMATTR InstName M4
SYMATTR Value2 l=1u w=3u
SYMBOL cktsym\\nmos4 -1440 608 M0
SYMATTR InstName M5
SYMATTR Value2 l=4u w=0.9u
SYMBOL cktsym\\nmos4 -1664 608 M0
SYMATTR InstName M6
SYMATTR Value2 l=4u w=4u
SYMBOL cktsym\\pmos4 -1440 208 M0
SYMATTR InstName M8
SYMATTR Value2 l=1u w=16u
SYMBOL cktsym\\pmos4 -1440 32 M0
SYMATTR InstName M9
SYMATTR Value2 l=4u w=16u
SYMBOL cktsym\\pmos4 -1664 224 R0
SYMATTR InstName M10
SYMATTR Value2 l=4u w=16u
SYMBOL cktsym\\nmos4 -1088 608 R0
SYMATTR InstName M11
SYMATTR Value2 l=4u w=4u
SYMBOL cktsym\\pmos4 -1088 32 R0
SYMATTR InstName M12
SYMATTR Value2 l=4u w=3.2u
SYMBOL cktsym\\nmos4 -1088 448 R0
SYMATTR InstName M13
SYMATTR Value2 l=4u w=16u
SYMBOL cktsym\\nmos4 -864 448 M0
SYMATTR InstName M14
SYMATTR Value2 l=4u w=4u
SYMBOL cktsym\\pmos4 -864 32 M0
SYMATTR InstName M15
SYMATTR Value2 l=4u w=16u
SYMBOL cktsym\\nmos4 -560 528 M0
SYMATTR InstName M16
SYMATTR Value2 l=0.9u w=3u
SYMBOL cktsym\\nmos4 -352 528 R0
SYMATTR InstName M17
SYMATTR Value2 l=0.9u w=3u

comparator_gainlatch.asc, the sub-circuit schematic file:
Version 4
SHEET 1 1328 1948
WIRE 32 48 32 -16
WIRE 240 48 240 -16
WIRE 432 48 432 -16
WIRE 640 112 496 112
WIRE 32 192 32 176
WIRE 32 192 -48 192
WIRE 96 192 96 112
WIRE 96 192 32 192
WIRE 368 192 96 192
WIRE 432 192 432 176
WIRE 240 208 240 176
WIRE 368 256 368 192
WIRE 464 320 432 320
WIRE 240 336 112 336
WIRE 304 336 240 336
WIRE 464 448 464 320
WIRE 768 448 464 448
WIRE 464 496 464 448
WIRE 464 496 -208 496
WIRE -48 528 -48 192
WIRE -48 528 -144 528
WIRE 112 528 112 464
WIRE 112 528 32 528
WIRE 304 528 304 464
WIRE 384 528 304 528
WIRE 464 528 464 496
WIRE 576 528 464 528
WIRE -208 592 -208 496
WIRE 32 592 32 528
WIRE 32 592 16 592
WIRE 48 592 32 592
WIRE 384 592 384 528
WIRE 384 592 368 592
WIRE 400 592 384 592
WIRE 640 592 640 112
WIRE 720 592 640 592
WIRE -48 656 -144 656
WIRE 112 656 -48 656
WIRE 224 656 112 656
WIRE 304 656 224 656
WIRE 464 656 304 656
WIRE 576 656 464 656
WIRE 224 688 224 656
WIRE 1024 1088 1024 1040
WIRE 1104 1152 1088 1152
WIRE 320 1232 320 1216
WIRE 320 1232 96 1232
WIRE 384 1232 384 1152
WIRE 432 1232 384 1232
WIRE 736 1232 736 1152
WIRE 736 1232 688 1232
WIRE 320 1264 320 1232
WIRE 736 1264 736 1232
WIRE 1104 1264 1104 1152
WIRE 1104 1264 736 1264
WIRE 96 1280 96 1232
WIRE 384 1328 384 1232
WIRE 16 1344 -80 1344
WIRE 32 1344 16 1344
WIRE 16 1408 16 1344
WIRE 96 1408 16 1408
WIRE 320 1408 320 1392
WIRE 384 1408 384 1328
WIRE 384 1408 320 1408
WIRE 800 1488 800 1216
WIRE 800 1488 688 1488
WIRE 1024 1488 1024 1216
WIRE 1120 1488 1024 1488
WIRE 800 1504 800 1488
WIRE 1024 1504 1024 1488
WIRE 688 1568 688 1488
WIRE 736 1568 688 1568
WIRE 1120 1568 1120 1488
WIRE 1120 1568 1088 1568
WIRE 416 1616 192 1616
WIRE 96 1664 96 1408
WIRE 320 1664 320 1408
WIRE 800 1664 800 1632
WIRE 1024 1664 1024 1632
WIRE 1024 1664 800 1664
WIRE 192 1728 192 1616
WIRE 192 1728 160 1728
WIRE 416 1728 416 1616
WIRE 416 1728 384 1728
WIRE 688 1728 688 1568
WIRE 688 1728 416 1728
WIRE 736 1728 688 1728
WIRE 96 1840 96 1792
WIRE 320 1840 320 1792
WIRE 800 1840 800 1792
FLAG 32 112 posA
FLAG 240 112 posA
FLAG 432 112 posA
FLAG 240 272 posA
FLAG 432 256 posA
FLAG 112 400 posA
FLAG 304 400 posA
FLAG -48 592 neg
FLAG -144 592 neg
FLAG 112 592 neg
FLAG 304 592 neg
FLAG 464 592 neg
FLAG 576 592 neg
FLAG 368 400 Vp
FLAG 48 400 Vm
FLAG 224 688 neg
FLAG 720 592 Disable
FLAG 768 448 Dout
FLAG 240 -16 posA
FLAG 176 272 Cascode
FLAG 176 112 Bias
FLAG 320 1728 neg
FLAG 96 1728 neg
FLAG 320 1840 neg
FLAG 96 1840 neg
FLAG 320 1328 posA
FLAG 320 1152 posA
FLAG 320 1088 posA
FLAG 96 1344 posA
FLAG -80 1344 Cascode
FLAG 432 1232 Bias
FLAG 800 1728 neg
FLAG 800 1840 neg
FLAG 800 1152 posA
FLAG 800 1088 posA
FLAG 688 1232 Bias
FLAG 800 1568 neg
FLAG 1024 1568 neg
FLAG 1024 1152 posA
FLAG 1024 1040 posA
FLAG 32 -16 posD
FLAG 432 -16 posD
SYMBOL cktsym\\pmos4 32 112 M0
SYMATTR InstName M1
SYMATTR Value2 l=2.7u w=9u
SYMBOL cktsym\\pmos4 240 112 R0
SYMATTR InstName M3
SYMATTR Value2 l=18u w=18u
SYMBOL cktsym\\pmos4 432 112 M0
SYMATTR InstName M2
SYMATTR Value2 l=2.7u w=9u
SYMBOL cktsym\\pmos4 240 272 R0
SYMATTR InstName M4
SYMATTR Value2 l=4.5u w=4.5u
SYMBOL cktsym\\pmos4 432 256 R0
SYMATTR InstName M5
SYMATTR Value2 l=2u w=.6u
SYMBOL cktsym\\pmos4 112 400 R0
SYMATTR InstName M6
SYMATTR Value2 l=3.6u w=7.2u
SYMBOL cktsym\\pmos4 304 400 M0
SYMATTR InstName M7
SYMATTR Value2 l=3.6u w=7.2u
SYMBOL cktsym\\nmos4 -144 592 R0
SYMATTR InstName M8
SYMATTR Value2 l=1.8u w=7.2u
SYMBOL cktsym\\nmos4 -48 592 M0
SYMATTR InstName M9
SYMATTR Value2 l=4.5u w=2.7u
SYMBOL cktsym\\nmos4 112 592 R0
SYMATTR InstName M10
SYMATTR Value2 l=4.5u w=2.7u
SYMBOL cktsym\\nmos4 304 592 M0
SYMATTR InstName M11
SYMATTR Value2 l=4.5u w=2.7u
SYMBOL cktsym\\nmos4 464 592 R0
SYMATTR InstName M12
SYMATTR Value2 l=4.5u w=2.7u
SYMBOL cktsym\\nmos4 576 592 M0
SYMATTR InstName M13
SYMATTR Value2 l=1.8u w=7.2u
SYMBOL cktsym\\nmos4 320 1728 M0
SYMATTR InstName M14
SYMATTR Value2 l=4u w=0.8u
SYMBOL cktsym\\nmos4 96 1728 M0
SYMATTR InstName M15
SYMATTR Value2 l=4u w=4u
SYMBOL cktsym\\pmos4 320 1328 M0
SYMATTR InstName M16
SYMATTR Value2 l=1.8u w=6.4u
SYMBOL cktsym\\pmos4 320 1152 M0
SYMATTR InstName M17
SYMATTR Value2 l=1.8u w=1.8u
SYMBOL cktsym\\pmos4 96 1344 R0
SYMATTR InstName M18
SYMATTR Value2 l=1.8u w=1.8u
SYMBOL cktsym\\nmos4 800 1728 R0
SYMATTR InstName M19
SYMATTR Value2 l=4u w=4u
SYMBOL cktsym\\pmos4 800 1152 R0
SYMATTR InstName M22
SYMATTR Value2 l=1.8u w=0.36u
SYMBOL cktsym\\nmos4 800 1568 R0
SYMATTR InstName M24
SYMATTR Value2 l=4u w=16u
SYMBOL cktsym\\nmos4 1024 1568 M0
SYMATTR InstName M25
SYMATTR Value2 l=4u w=4u
SYMBOL cktsym\\pmos4 1024 1152 M0
SYMATTR InstName M20
SYMATTR Value2 l=1.8u w=1.8u

spdt_1.asc, the sub-circuit schematic file:
Version 4
SHEET 1 880 680
WIRE -16 160 -64 160
WIRE 0 160 -16 160
WIRE 336 160 128 160
WIRE -16 240 -16 160
WIRE 192 240 -16 240
WIRE 336 240 336 160
WIRE 336 240 320 240
WIRE 64 320 64 224
WIRE 64 320 -48 320
WIRE 256 320 256 304
WIRE 336 320 336 240
WIRE 384 320 336 320
WIRE 256 336 256 320
WIRE 192 400 -16 400
WIRE 336 400 336 320
WIRE 336 400 320 400
WIRE 64 416 64 320
WIRE -16 480 -16 400
WIRE -16 480 -64 480
WIRE 0 480 -16 480
WIRE 336 480 336 400
WIRE 336 480 128 480
FLAG 256 240 V-
FLAG 64 160 V+
FLAG 256 400 V+
FLAG 64 480 V-
FLAG 256 320 S
FLAG -64 160 IN1
FLAG -64 480 IN2
FLAG 384 320 OUT
FLAG -112 368 V-
FLAG -112 272 V+
FLAG -176 320 S
SYMBOL cktsym\\nmos4 256 240 M270
SYMATTR InstName M1
SYMATTR Value2 l=nmosL w=nmosW
SYMBOL cktsym\\pmos4 64 160 M270
SYMATTR InstName M2
SYMATTR Value2 l=pmosL w=pmosW
SYMBOL cktsym\\pmos4 256 400 M90
SYMATTR InstName M3
SYMATTR Value2 l=pmosL w=pmosW
SYMBOL cktsym\\nmos4 64 480 M90
SYMATTR InstName M4
SYMATTR Value2 l=nmosL w=nmosW
SYMBOL Inverter -112 320 R0
SYMATTR InstName X1
SYMATTR SpiceLine nmosL=nmosL nmosW=nmosW pmosL=pmosL pmosW=pmosW

The netlist it stands for:
* adc_test.asc
XX1 N015 N018 Iin? C1? C2? N023 N026 Vdd 0 N016 N019 analog_switch_current_steer
XX2 LSB_CE CLK CLKb W_OUT N003 RST_IR N004 RSTb Vdd 0 N005 N006 N007 N008 N009 N010 N011 N012 N013 N014 N021 lsb_registers  ; pins LSB_CLK SYS_CLK SYS_CLKb W_CLK W_CLKb RST_IR RST_IRb RST_ORb pos neg Bit2 Bit3 Bit4 Bit5 Bit6 Bit7 Bit8 Bit9 Bit10 Bit11 Done?
XX3 MSB_CE CLK CLKb W_OUT N003 N004 RSTb Vdd 0 N001 N002 msb_registers  ; pins MSB_CLK SYS_CLK SYS_CLKb W_CLK W_CLKb RST_IRb RST_ORb pos neg Bit0 Bit1
XX5 N035 N040 N044 N036 N049 RSTb Vdd 0 FlipFlop nmosL=0.9u nmosW=3u pmosL=0.9u pmosW=6u  ; pins D CLK CLKb Q Qb RESETb pos neg
XX6 N038 N040 N044 N027 N047 RSTb Vdd 0 FlipFlop nmosL=0.9u nmosW=3u pmosL=0.9u pmosW=6u  ; pins D CLK CLKb Q Qb RESETb pos neg
V1 Vdd 0 2V
V2 CLK 0 PULSE(0 2 .2u 1n 1n 5u 10u 50)
V3 RSTb 0 PWL(0 0 300n 0 325n 2 40u 2)
XX13 N043 N044 Vdd 0 Inverter nmosL=0.9u nmosW=6u pmosL=0.9u pmosW=12u  ; pins IN OUT pos neg
XX18 N030 N035 N041 Vdd 0 NAND nmosL=0.9u nmosW=3u pmosL=0.9u pmosW=6u  ; pins A OUT B Vdd GROUND
XX19 N031 N030 GO? Vdd 0 NAND nmosL=0.9u nmosW=3u pmosL=0.9u pmosW=6u  ; pins A OUT B Vdd GROUND
XX20 GO? N038 N042 Vdd 0 NOR nmosL=0.9u nmosW=3u pmosL=0.9u pmosW=6u  ; pins A OUT B Vdd GROUND
XX21 N032 N040 N044 N033 N048 RSTb Vdd 0 FlipFlop nmosL=0.9u nmosW=3u pmosL=0.9u pmosW=6u  ; pins D CLK CLKb Q Qb RESETb pos neg
XX22 N033 N040 N044 N034 N041 RSTb Vdd 0 FlipFlop nmosL=0.9u nmosW=3u pmosL=0.9u pmosW=6u  ; pins D CLK CLKb Q Qb RESETb pos neg
XX23 N036 N040 N044 N037 N046 RSTb Vdd 0 FlipFlop nmosL=0.9u nmosW=3u pmosL=0.9u pmosW=6u  ; pins D CLK CLKb Q Qb RESETb pos neg
XX24 N037 N040 N044 N031 N042 RSTb Vdd 0 FlipFlop nmosL=0.9u nmosW=3u pmosL=0.9u pmosW=6u  ; pins D CLK CLKb Q Qb RESETb pos neg
XX25 N042 N046 N041 Vdd 0 N039 NAND3 nmosL=0.9u nmosW=3u pmosL=0.9u pmosW=6u  ; pins A B C pos neg OUT
XX26 N048 Iin? Vdd 0 Inverter nmosL=0.9u nmosW=3u pmosL=0.9u pmosW=6u  ; pins IN OUT pos neg
XX27 N046 C2? N041 Vdd 0 NAND nmosL=0.9u nmosW=3u pmosL=0.9u pmosW=6u  ; pins A OUT B Vdd GROUND
XX28 N049 N042 N048 Vdd 0 C1? NAND3 nmosL=0.9u nmosW=3u pmosL=0.9u pmosW=6u  ; pins A B C pos neg OUT
XX29 N048 N050 N045 Vdd 0 NAND nmosL=0.9u nmosW=3u pmosL=0.9u pmosW=6u  ; pins A OUT B Vdd GROUND
XX30 N047 N051 N049 Vdd 0 NAND nmosL=0.9u nmosW=3u pmosL=0.9u pmosW=6u  ; pins A OUT B Vdd GROUND
XX31 N051 N053 N050 Vdd 0 NOR nmosL=0.9u nmosW=3u pmosL=0.9u pmosW=6u  ; pins A OUT B Vdd GROUND
XX32 N053 DIS_CO? Vdd 0 Inverter nmosL=0.9u nmosW=3u pmosL=0.9u pmosW=6u  ; pins IN OUT pos neg
XX34 N041 MSB_CE Vdd 0 Inverter nmosL=0.9u nmosW=6u pmosL=0.9u pmosW=12u  ; pins IN OUT pos neg
XX36 N042 LSB_CE N046 Vdd 0 NAND nmosL=0.9u nmosW=9u pmosL=0.9u pmosW=18u  ; pins A OUT B Vdd GROUND
XX37 N045 RST_IR Vdd 0 Inverter nmosL=0.9u nmosW=3u pmosL=0.9u pmosW=6u  ; pins IN OUT pos neg
Iin1 Vdd N015 205n
Iref1 Vdd N018 100n
XX38 RST_C1_CO? N025 Vdd 0 Inverter nmosL=0.9u nmosW=3u pmosL=0.9u pmosW=6u  ; pins IN OUT pos neg
XX39 RST_IR N004 Vdd 0 Inverter nmosL=0.9u nmosW=9u pmosL=0.9u pmosW=18u  ; pins IN OUT pos neg
XX40 W_OUT N003 Vdd 0 Inverter nmosL=0.9u nmosW=9u pmosL=0.9u pmosW=18u  ; pins IN OUT pos neg
XX41 N021 GO? Vdd 0 Inverter nmosL=0.9u nmosW=3u pmosL=0.9u pmosW=6u  ; pins IN OUT pos neg
XX42 N017 N020 DIS_CO? Casc Bias Vpw1 Vpw2 VddA Vdd 0 N022 NC_01 comparator
V6 VddA 0 3V
V11 Vpw1 0 0.7
V12 Vpw2 0 0.5
V8 Bias 0 1.15
XX7 CLK CLKb Vdd 0 Inverter nmosL=0.9u nmosW=9u pmosL=0.9u pmosW=18u  ; pins IN OUT pos neg
XX10 COb N024 N025 Vdd 0 NOR nmosL=0.9u nmosW=3u pmosL=0.9u pmosW=6u  ; pins A OUT B Vdd GROUND
XX43 COb N028 N029 Vdd 0 NOR nmosL=0.9u nmosW=3u pmosL=0.9u pmosW=6u  ; pins A OUT B Vdd GROUND
XX44 RST_IR P001 N028 Vdd 0 NOR nmosL=0.9u nmosW=3u pmosL=0.9u pmosW=6u  ; pins A OUT B Vdd GROUND
XX45 P001 N026 Vdd 0 Inverter nmosL=0.9u nmosW=3u pmosL=0.9u pmosW=6u  ; pins IN OUT pos neg
XX46 RST_IR P002 N024 Vdd 0 NOR nmosL=0.9u nmosW=3u pmosL=0.9u pmosW=6u  ; pins A OUT B Vdd GROUND
XX47 P002 N023 Vdd 0 Inverter nmosL=0.9u nmosW=3u pmosL=0.9u pmosW=6u  ; pins IN OUT pos neg
XX48 RST_C2_CO? N029 Vdd 0 Inverter nmosL=0.9u nmosW=3u pmosL=0.9u pmosW=6u  ; pins IN OUT pos neg
XX49 RST_C2_CO? N052 Vdd 0 Inverter nmosL=0.9u nmosW=3u pmosL=0.9u pmosW=6u  ; pins IN OUT pos neg
XX50 N046 RST_C1_CO? N052 Vdd 0 NAND nmosL=0.9u nmosW=3u pmosL=0.9u pmosW=6u  ; pins A OUT B Vdd GROUND
XX33 N042 RST_C2_CO? N041 Vdd 0 NAND nmosL=0.9u nmosW=3u pmosL=0.9u pmosW=6u  ; pins A OUT B Vdd GROUND
XX4 N027 N040 N044 N032 N045 RST Vdd 0 highResetFlipFlop nmosL=0.9u nmosW=3u pmosL=0.9u pmosW=6u  ; pins D CLK CLKb Q Qb RESET pos neg
XX8 RSTb RST Vdd 0 Inverter nmosL=0.9u nmosW=9u pmosL=0.9u pmosW=18u  ; pins IN OUT pos neg
XX9 CO CLK N043 N039 Vdd 0 spdt_1 params: nmosL=0.9u nmosW=3u pmosL=0.9u pmosW=6u
XX11 N022 COb Vdd 0 Inverter nmosL=0.9u nmosW=6u pmosL=0.9u pmosW=12u  ; pins IN OUT pos neg
XX12 COb CO Vdd 0 Inverter nmosL=0.9u nmosW=6u pmosL=0.9u pmosW=12u  ; pins IN OUT pos neg
XX14 N016 N019 N017 C2Ref? Vdd 0 spdt_1 params: nmosL=0.9u nmosW=3u pmosL=0.9u pmosW=6u
XX15 N044 N040 Vdd 0 Inverter nmosL=0.9u nmosW=6u pmosL=0.9u pmosW=12u  ; pins IN OUT pos neg
XX16 N019 N016 N020 C2Ref? Vdd 0 spdt_1 params: nmosL=0.9u nmosW=3u pmosL=0.9u pmosW=6u
XX17 N042 C2Ref? Vdd 0 Inverter nmosL=0.9u nmosW=3u pmosL=0.9u pmosW=6u  ; pins IN OUT pos neg
XX54 P003 W_OUT Vdd 0 Inverter nmosL=0.9u nmosW=9u pmosL=0.9u pmosW=18u  ; pins IN OUT pos neg
XX35 P004 P003 Vdd 0 Inverter nmosL=0.9u nmosW=0.9u pmosL=0.9u pmosW=1.8u  ; pins IN OUT pos neg
XX51 P005 P004 Vdd 0 Inverter nmosL=0.9u nmosW=0.9u pmosL=0.9u pmosW=1.8u  ; pins IN OUT pos neg
XX52 P006 P005 Vdd 0 Inverter nmosL=0.9u nmosW=0.9u pmosL=0.9u pmosW=1.8u  ; pins IN OUT pos neg
XX53 N047 P006 Vdd 0 Inverter nmosL=0.9u nmosW=0.9u pmosL=0.9u pmosW=1.8u  ; pins IN OUT pos neg

* block symbol definitions
.subckt analog_switch_current_steer Iin Iref Iin? C1? C2? CLC1 CLC2 pos neg VC1 VC2
M1 VC1 N001 Iin pos PMOS l={2*A} w={6*A}
M2 VC2 N005 Iin pos PMOS l={2*A} w={6*A}
M4 VC1 N003 Iref pos PMOS l={2*A} w={6*A}
M5 VC2 N007 Iref pos PMOS l={2*A} w={6*A}
M6 neg N006 Iref pos PMOS l={2*A} w={6*A}
C1 VC1 neg 10p
C2 VC2 neg 10p
M24 VC1 CLC1 neg neg NMOS l={2*A} w={24*A}
M28 neg CLC2 VC2 neg NMOS l={2*A} w={24*A}
M3 neg N004 Iin pos PMOS l={2*A} w={6*A}
XX1 Iin? N001 C1? pos neg NAND nmosL={2*A} pmosL={2*A} nmosW={3*A} pmosW={6*A}  ; pins A OUT B Vdd GROUND
XX2 Iin? N002 pos neg Inverter nmosL={2*A} pmosL={2*A} nmosW={3*A} pmosW={6*A}  ; pins IN OUT pos neg
XX3 Iin? N005 C2? pos neg NAND nmosL={2*A} pmosL={2*A} nmosW={3*A} pmosW={6*A}  ; pins A OUT B Vdd GROUND
XX4 N001 N004 N005 pos neg NAND nmosL={2*A} pmosL={2*A} nmosW={3*A} pmosW={6*A}  ; pins A OUT B Vdd GROUND
XX5 N002 N003 C1? pos neg NAND nmosL={2*A} pmosL={2*A} nmosW={3*A} pmosW={6*A}  ; pins A OUT B Vdd GROUND
XX6 N002 N007 C2? pos neg NAND nmosL={2*A} pmosL={2*A} nmosW={3*A} pmosW={6*A}  ; pins A OUT B Vdd GROUND
XX7 N003 N006 N007 pos neg NAND nmosL={2*A} pmosL={2*A} nmosW={3*A} pmosW={6*A}  ; pins A OUT B Vdd GROUND
* !(Iin to C2)
* !(Iin to C1)
.param A=0.3u
* !(Shunt Iin to Gnd)
* Iref
* !(Iref to C1)
* !(Iref to C2)
* !(Shunt Iref to Gnd)
* Inputs: Iin, Iref, Iin?, C1?, C2?, CLC1, CLC2, pos, neg
* Outputs: VC1, VC2
.ends analog_switch_current_steer

.subckt comparator Vin Vth Disable Cascode Bias Vpw1 Vpw2 posA posD neg Out Outb
XX1 N006 Disable N007 Vpw1 Vpw2 posD neg Out Outb pulse_width_control A=0.3u  ; pins Din Reset ResetB Vpw1 Vpw2 pos neg Out OutB
XX2 N004 N005 posD neg Inverter nmosL=0.9u nmosW=3u pmosL=0.9u pmosW=6u  ; pins IN OUT pos neg
XX3 N005 N006 posD neg Inverter nmosL=0.9u nmosW=3u pmosL=0.9u pmosW=6u  ; pins IN OUT pos neg
XX4 Vin Vth Cascode Bias posA neg N001 N002 comparator_preamp
XX5 N001 N002 N003 Cascode Bias posA posD neg N004 comparator_gainlatch
XX6 Disable N007 posD neg Inverter nmosL=0.9u nmosW=3u pmosL=0.9u pmosW=6u  ; pins IN OUT pos neg
XX7 Disable N008 posD neg Inverter nmosL=0.9u nmosW=3u pmosL=0.9u pmosW=6u  ; pins IN OUT pos neg
XX8 N008 N003 Outb posD neg NAND nmosL=0.9u nmosW=3u pmosL=0.9u pmosW=6u  ; pins A OUT B Vdd GROUND
.ends comparator

.subckt comparator_preamp Input Thresh Cascode Bias pos neg Vp Vm
M1 N001 Bias pos pos PMOS l=4u w=16u
M2 N003 Cascode N001 pos PMOS l=.8u w=3.2u
M3 Vm Input N003 pos PMOS l=1u w=3u
M4 Vp Thresh N003 pos PMOS l=1u w=3u
M5 Bias N004 neg neg NMOS l=4u w=0.9u
M6 Cascode N004 neg neg NMOS l=4u w=4u
M8 Bias Bias N002 pos PMOS l=1u w=16u
M9 N002 Bias pos pos PMOS l=4u w=16u
M10 Cascode Cascode N002 pos PMOS l=4u w=16u
M11 N006 N004 neg neg NMOS l=4u w=4u
M12 N004 Bias pos pos PMOS l=4u w=3.2u
M13 N004 N004 N006 neg NMOS l=4u w=16u
M14 N005 N005 N006 neg NMOS l=4u w=4u
M15 N005 Bias pos pos PMOS l=4u w=16u
M16 Vm Vm neg neg NMOS l=0.9u w=3u
M17 Vp Vm neg neg NMOS l=0.9u w=3u
.ends comparator_preamp

.subckt comparator_gainlatch Vp Vm Disable Cascode Bias posA posD neg Dout
M1 N001 N001 posD posA PMOS l=2.7u w=9u
M3 N003 Bias posA posA PMOS l=18u w=18u
M2 N002 Disable posD posA PMOS l=2.7u w=9u
M4 N004 Cascode N003 posA PMOS l=4.5u w=4.5u
M5 Dout N001 N002 posA PMOS l=2u w=.6u
M6 N005 Vm N004 posA PMOS l=3.6u w=7.2u
M7 N006 Vp N004 posA PMOS l=3.6u w=7.2u
M8 N001 Dout neg neg NMOS l=1.8u w=7.2u
M9 N001 N005 neg neg NMOS l=4.5u w=2.7u
M10 N005 N005 neg neg NMOS l=4.5u w=2.7u
M11 N006 N006 neg neg NMOS l=4.5u w=2.7u
M12 Dout N006 neg neg NMOS l=4.5u w=2.7u
M13 Dout Disable neg neg NMOS l=1.8u w=7.2u
M14 Bias N008 neg neg NMOS l=4u w=0.8u
M15 Cascode N008 neg neg NMOS l=4u w=4u
M16 Bias Bias N007 posA PMOS l=1.8u w=6.4u
M17 N007 Bias posA posA PMOS l=1.8u w=1.8u
M18 Cascode Cascode N007 posA PMOS l=1.8u w=1.8u
M19 N010 N008 neg neg NMOS l=4u w=4u
M22 N008 Bias posA posA PMOS l=1.8u w=0.36u
M24 N008 N008 N010 neg NMOS l=4u w=16u
M25 N009 N009 N010 neg NMOS l=4u w=4u
M20 N009 Bias posA posA PMOS l=1.8u w=1.8u
.ends comparator_gainlatch

.subckt spdt_1 IN1 IN2 OUT S V+ V-
M1 OUT S IN1 V- NMOS l=nmosL w=nmosW
M2 IN1 N001 OUT V+ PMOS l=pmosL w=pmosW
M3 OUT S IN2 V+ PMOS l=pmosL w=pmosW
M4 IN2 N001 OUT V- NMOS l=nmosL w=nmosW
XX1 S N001 V+ V- Inverter nmosL=nmosL nmosW=nmosW pmosL=pmosL pmosW=pmosW  ; pins IN OUT pos neg
.ends spdt_1

.model NMOS NMOS
.model PMOS PMOS
.lib standard.mos
.tran 0 500u 0
.include engr3426.sub
* Sreset
* Sin
* Sref*
* Stvnp
* Svtnp*
* S2xnp*
* Sexit
* High = CLK2 = CO
.backanno
.end